# Altium schematic sheet MCU Module.SchDoc
size A; SheetNumber: 1; SheetTotal: 5
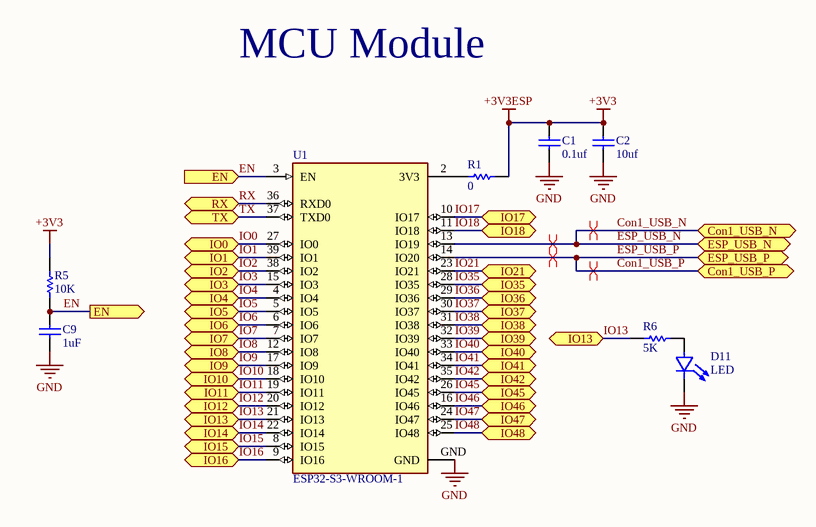
[diagram p0: MCU Module.SchDoc]

## Parts
C1  0.1uf  [C0402]
C2  10uf  [C0402]
C9  1uF  [C0402]
D11  LED  [LED0402]
R1  0  [R0402]
R5  10K  [R0402]
R6  5K  [R0402]
U1  ESP32-S3-WROOM-1  [ESP32]

## Ports
Con1_USB_N (bidir, see Connectors[2B], Connectors[3B]), Con1_USB_P (bidir, see Connectors[2B], Connectors[3B]), EN (in, see Connectors[1A], MCU Module[2C], Power Circuit[2C], USB to UART[4B]), EN (out, see Connectors[1A], MCU Module[2B], Power Circuit[2C], USB to UART[4B]), ESP_USB_N (bidir, see Connectors[4B]), ESP_USB_P (bidir, see Connectors[4B]), IO0 (bidir, see Connectors[4B], Power Circuit[3C], USB to UART[4C]), IO1 (bidir, see Connectors[4B]), IO2 (bidir, see Connectors[4B]), IO3 (bidir, see Connectors[1B]), IO4 (bidir, see Connectors[1B]), IO5 (bidir, see Connectors[1B]), IO6 (bidir, see Connectors[1B]), IO7 (bidir, see Connectors[1B]), IO8 (bidir, see Connectors[1B]), IO9 (bidir, see Connectors[1B]), IO10 (bidir, see Connectors[1B]), IO11 (bidir, see Connectors[1B]), IO12 (bidir, see Connectors[1B]), IO13 (bidir, see Connectors[1B], MCU Module[2C]), IO13 (bidir, see Connectors[1B], MCU Module[3C]), IO14 (bidir, see Connectors[1B]), IO15 (bidir, see Connectors[1B]), IO16 (bidir, see Connectors[1B]), IO17 (bidir, see Connectors[1B]), IO18 (bidir, see Connectors[1B]), IO21 (bidir, see Connectors[4B]), IO35 (bidir, see Connectors[4B]), IO36 (bidir, see Connectors[4B]), IO37 (bidir, see Connectors[4B]), IO38 (bidir, see Connectors[4B]), IO39 (bidir, see Connectors[4B]), IO40 (bidir, see Connectors[4B], Peripherals[2B]), IO41 (bidir, see Connectors[4B]), IO42 (bidir, see Connectors[4B]), IO45 (bidir, see Connectors[4B]), IO46 (bidir, see Connectors[1B]), IO47 (bidir, see Connectors[4B]), IO48 (bidir, see Connectors[4B]), RX (bidir, see Connectors[4A], USB to UART[3B]), TX (bidir, see Connectors[4A], USB to UART[3B])

## Nets
+3V3: C1.01(+) C2.01(+) R1.01 R5.02  [also labelled +3V3ESP]
GND: C1.02(-) C2.02(-) C9.01(+) D11.1(C) U1.GND
Con1_USB_N: U1.13(IO19) ; port ESP_USB_N, port Con1_USB_N  [also labelled ESP_USB_N]
Con1_USB_P: U1.14(IO20) ; port ESP_USB_P, port Con1_USB_P  [also labelled ESP_USB_P]
EN: C9.02(-) R5.01 U1.3(EN) ; port EN
IO0: U1.27(IO0) ; port IO0
IO1: U1.39(IO1) ; port IO1
IO2: U1.38(IO2) ; port IO2
IO3: U1.15(IO3) ; port IO3
IO4: U1.4(IO4) ; port IO4
IO5: U1.5(IO5) ; port IO5
IO6: U1.6(IO6) ; port IO6
IO7: U1.7(IO7) ; port IO7
IO8: U1.12(IO8) ; port IO8
IO9: U1.17(IO9) ; port IO9
IO10: U1.18(IO10) ; port IO10
IO11: U1.19(IO11) ; port IO11
IO12: U1.20(IO12) ; port IO12
IO13: R6.02 U1.21(IO13) ; port IO13
IO14: U1.22(IO14) ; port IO14
IO15: U1.8(IO15) ; port IO15
IO16: U1.9(IO16) ; port IO16
IO17: U1.10(IO17) ; port IO17
IO18: U1.11(IO18) ; port IO18
IO21: U1.23(IO21) ; port IO21
IO35: U1.28(IO35) ; port IO35
IO36: U1.29(IO36) ; port IO36
IO37: U1.30(IO37) ; port IO37
IO38: U1.31(IO38) ; port IO38
IO39: U1.32(IO39) ; port IO39
IO40: U1.33(IO40) ; port IO40
IO41: U1.34(IO41) ; port IO41
IO42: U1.35(IO42) ; port IO42
IO45: U1.26(IO45) ; port IO45
IO46: U1.16(IO46) ; port IO46
IO47: U1.24(IO47) ; port IO47
IO48: U1.25(IO48) ; port IO48
RX: U1.36(RXD0) ; port RX
TX: U1.37(TXD0) ; port TX
NetD11_2: D11.2(A) R6.01
NetR1_02: R1.02 U1.2(3V3)

## Layout directives
differential pair; differential pair class DIFF90: Con1_USB_N, Con1_USB_P

## Notes on the sheet
- MCU Module

## Library data of the parts
C1 C2 C9 = Cap
R1 R5 R6 = Res
U1 = ESP32-S3-WROOM-1: Bluetooth, WiFi 802.11b/g/n, Bluetooth v5.0 Transceiver Module 2.4GHz PCB Trace Surface Mount